# Altium project VVBlock.PrjPcb
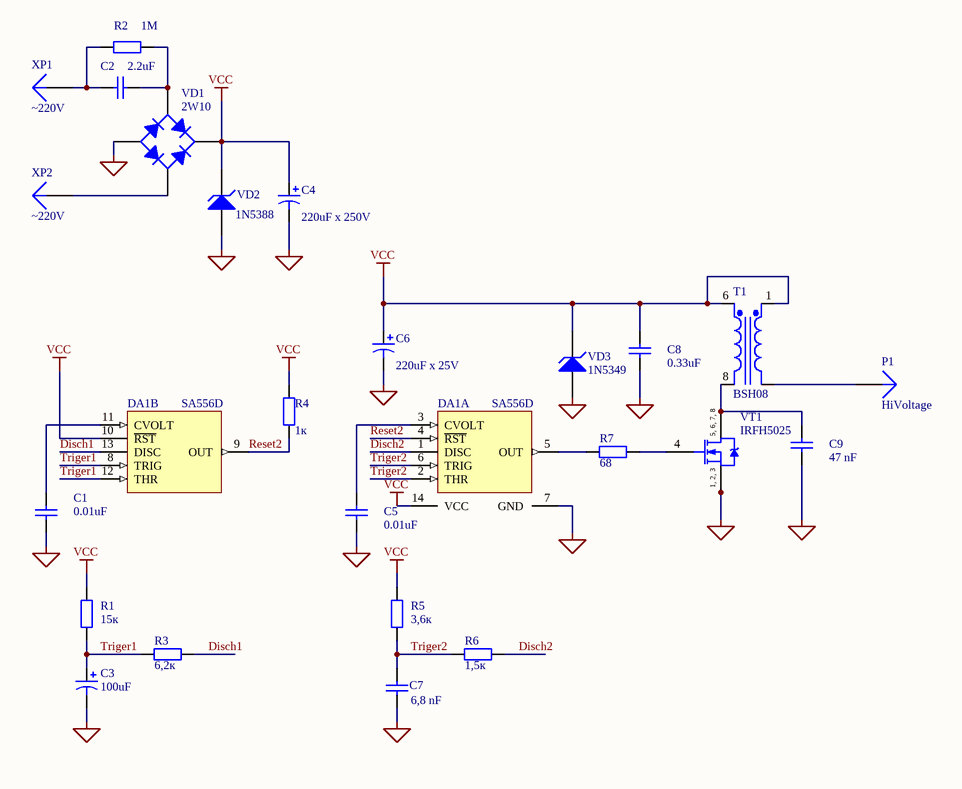
[diagram p0: VVblock.SchDoc]
1 sheet, 25 parts. Net scope: global (net labels, ports and power ports of the same name join across sheets).
Board file: VVBlock.PcbDoc

## Sheet VVblock.SchDoc
size A4; PageSetup: Record=PageOptions|CenterHorizontal=True|CenterVertical=True|PrintScale=1.48|XCorrection=1.00|YCorrection=1.00|PrintKind=1|BorderSize=5000000|LeftOffset=0|BottomOffset=0|Orientation=2|PaperLength=2970|PaperWidth=2100|Scale=100|PaperSource=4|PrintQuality=600|MediaType=1|DitherType=10|PaperKind=A4|PrintScaleMode=1

### Parts
C1  value 0.01uF  [CAPC2012N]  (hidden comment: Cap)
C2  value 2.2uF  [RAD-0.3]  (hidden comment: Cap)
C3  value 100uF  [CAPPR2.5-6.3x11]  (hidden comment: Cap Pol1)
C4  value 220uF x 250V  [CAPPR5-10x20]  (hidden comment: Cap Pol1)
C5  value 0.01uF  [CAPC2012N]  (hidden comment: Cap)
C6  value 220uF x 25V  [CAPPR5-10x20]  (hidden comment: Cap Pol1)
C7  value 6,8 nF  [CAPC2012N]  (hidden comment: Cap)
C8  value 0.33uF  [CAPC2012N]  (hidden comment: Cap)
C9  value 47 nF  [CAPC2012N]  (hidden comment: Cap)
DA1  SA556D  [SO14_N]  (parts A,B of 2)
P1  HiVoltage  [PIN1]
R1  value 15к  [resc2012N]  (hidden comment: Res2)
R2  value 1M  [AXIAL-0.4]  (hidden comment: Res2)
R3  value 6,2к  [RESC2012N]  (hidden comment: Res2)
R4  value 1к  [RESC2012N]  (hidden comment: Res2)
R5  value 3,6к  [RESC2012N]  (hidden comment: Res2)
R6  value 1,5к  [RESC2012N]  (hidden comment: Res2)
R7  value 68  [RESC2012N]  (hidden comment: Res2)
T1  BSH08  [TRF_4]
VD1  2W10  [SW/PB-V4/H7.1]
VD2  1N5388  [DIODE-0.7]
VD3  1N5349  [DIODE-0.7]
VT1  IRFH5025  [SO-8_N]
XP1  ~220V  [PIN1]
XP2  ~220V  [PIN1]

### Nets
GND: C1.1 C3.2 C4.2 C5.1 C6.2 C7.1 C8.1 C9.1 DA1.7(GND) VD1.3(A) VD2.1(A) VD3.1(A) VT1.1(S) VT1.2(S) VT1.3(S)
VCC: C4.1 C6.1 C8.2 DA1.10(~{RST}) DA1.14(VCC) R1.2 R4.2 R5.2 T1.1(ABL) T1.6(+B) VD1.1(K) VD2.2(K) VD3.2(K)
Disch1: DA1.13(DISC) R3.1
Disch2: DA1.1(DISC) R6.1
Reset2: DA1.4(~{RST}) DA1.9(OUT) R4.1
Triger1: C3.1 DA1.8(TRIG) DA1.12(THR) R1.1 R3.2
Triger2: C7.2 DA1.2(THR) DA1.6(TRIG) R5.1 R6.2
NetC1_2: C1.2 DA1.11(CVOLT)
NetC2_1: C2.1 R2.2 VD1.4(C)
NetC2_2: C2.2 R2.1 XP1.1
NetC5_2: C5.2 DA1.3(CVOLT)
NetC9_2: C9.2 T1.8(Collector) VT1.5(D) VT1.6(D) VT1.7(D) VT1.8(D)
NetDA1_5: DA1.5(OUT) R7.2
NetP1_1: P1.1 T1.4(Anode_CRT)
NetR7_1: R7.1 VT1.4(G)
NetVD1_2: VD1.2(C) XP2.1

### Notes on the sheet
- (in symbol IRF7474) 5, 6, 7, 8; 1, 2, 3

### Library data of the parts
C1 C2 C5 C7-C9 = Cap: Capacitor; Published: 8-Jun-2000; LatestRevisionDate: 17-Jul-2002; LatestRevisionNote: Re-released for DXP Platform.; PackageReference: RAD-0.3; Publisher: Altium Limited; PackageDescription: Radial Cap, Thru-Hole; 2 Leads; 0.3 in Pin Spacing
C3 C4 C6 = Cap Pol1: Polarized Capacitor (Radial); Published: 8-Jun-2000; LatestRevisionDate: 17-Jul-2002; LatestRevisionNote: Re-released for DXP Platform.; PackageReference: RB7.6-15; Publisher: Altium Limited; PackageDescription: Polarized Capacitor (Radial); 2 Leads
DA1 = SA556D: General-Purpose Dual Bipolar Timer; Published: 24-Aug-2001; LatestRevisionDate: 13-Apr-2006; LatestRevisionNote: IPC-7351 Footprint Added.; DatasheetVersion: Jul-1998; PackageVersion: Sep-1998; PackageReference: SO14; Publisher: Altium Limited; PackageDescription: 14-Pin Small Outline Integrated Circuit 1.27 mm Pitch; Code_IPC: SOIC127P600-14; ComponentLink1Description: Manufacturer Link; ComponentLink1URL: http://www.st.com/; ComponentLink2Description: Datasheet; ComponentLink2URL: http://www.st.com/stonline/products/literature/ds/2183/ne556.pdf
P1 XP1 XP2 = Plug: LatestRevisionDate: 17-Jul-2002; LatestRevisionNote: Re-released for DXP Platform.; Publisher: Altium Limited
R1-R7 = Res2: Resistor; Published: 8-Jun-2000; LatestRevisionDate: 17-Jul-2002; LatestRevisionNote: Re-released for DXP Platform.; PackageReference: AXIAL-0.4; Publisher: Altium Limited; PackageDescription: Axial Device, Thru-Hole; 2 Leads; 0.4 in Pin Spacing
T1 = Trans Cupl: Transformer (Coupled Inductor Model); Published: 8-Jun-2000; LatestRevisionDate: 17-Jul-2002; LatestRevisionNote: Re-released for DXP Platform.; PackageReference: TRF_4; Publisher: Altium Limited; PackageDescription: Transformer; 4 Leads
VD1 = Bridge1: Full Wave Diode Bridge; Published: 8-Jun-2000; LatestRevisionDate: 29-May-2009; LatestRevisionNote: Sch pins A & K swapped.; DatasheetVersion: E2732B; PackageReference: D-38; Publisher: Altium Limited; PackageDescription: Bridge Rectifier; 4 Terminals; Body 9.4 x 9.4 mm (typ); Pitch 5.08 mm
VD2 VD3 = D Zener: Zener Diode; Published: 8-Jun-2000; LatestRevisionDate: 17-Jul-2002; LatestRevisionNote: Re-released for DXP Platform.; PackageReference: DIODE-0.7; Publisher: Altium Limited; PackageDescription: Diode, Thru-Hole; 2 Leads; 0.7 in Pin Spacing
VT1 = IRF7474: HEXFET Power MOSFET; Published: 17-Sep-2003; LatestRevisionDate: 13-Apr-2006; LatestRevisionNote: IPC-7351 Footprint Added.; DatasheetVersion: 3-Sep-2001; PackageVersion: Feb-2001; PackageReference: SO-8; Publisher: Altium Limited; PackageDescription: 8-Pin Plastic Small Outline Integrated Circuit 1.27 mm Pitch; Code_JEDEC: MS-012-AA; Code_IPC: SOIC127P600-8; ComponentLink1Description: Manufacturer Link; ComponentLink1URL: http://www.irf.com/; ComponentLink2Description: Datasheet; ComponentLink2URL: http://www.irf.com/product-info/datasheets/data/irf7474.pdf